# EAGLE design pwmdrive_2014_001 (EAGLE 6.5.0)
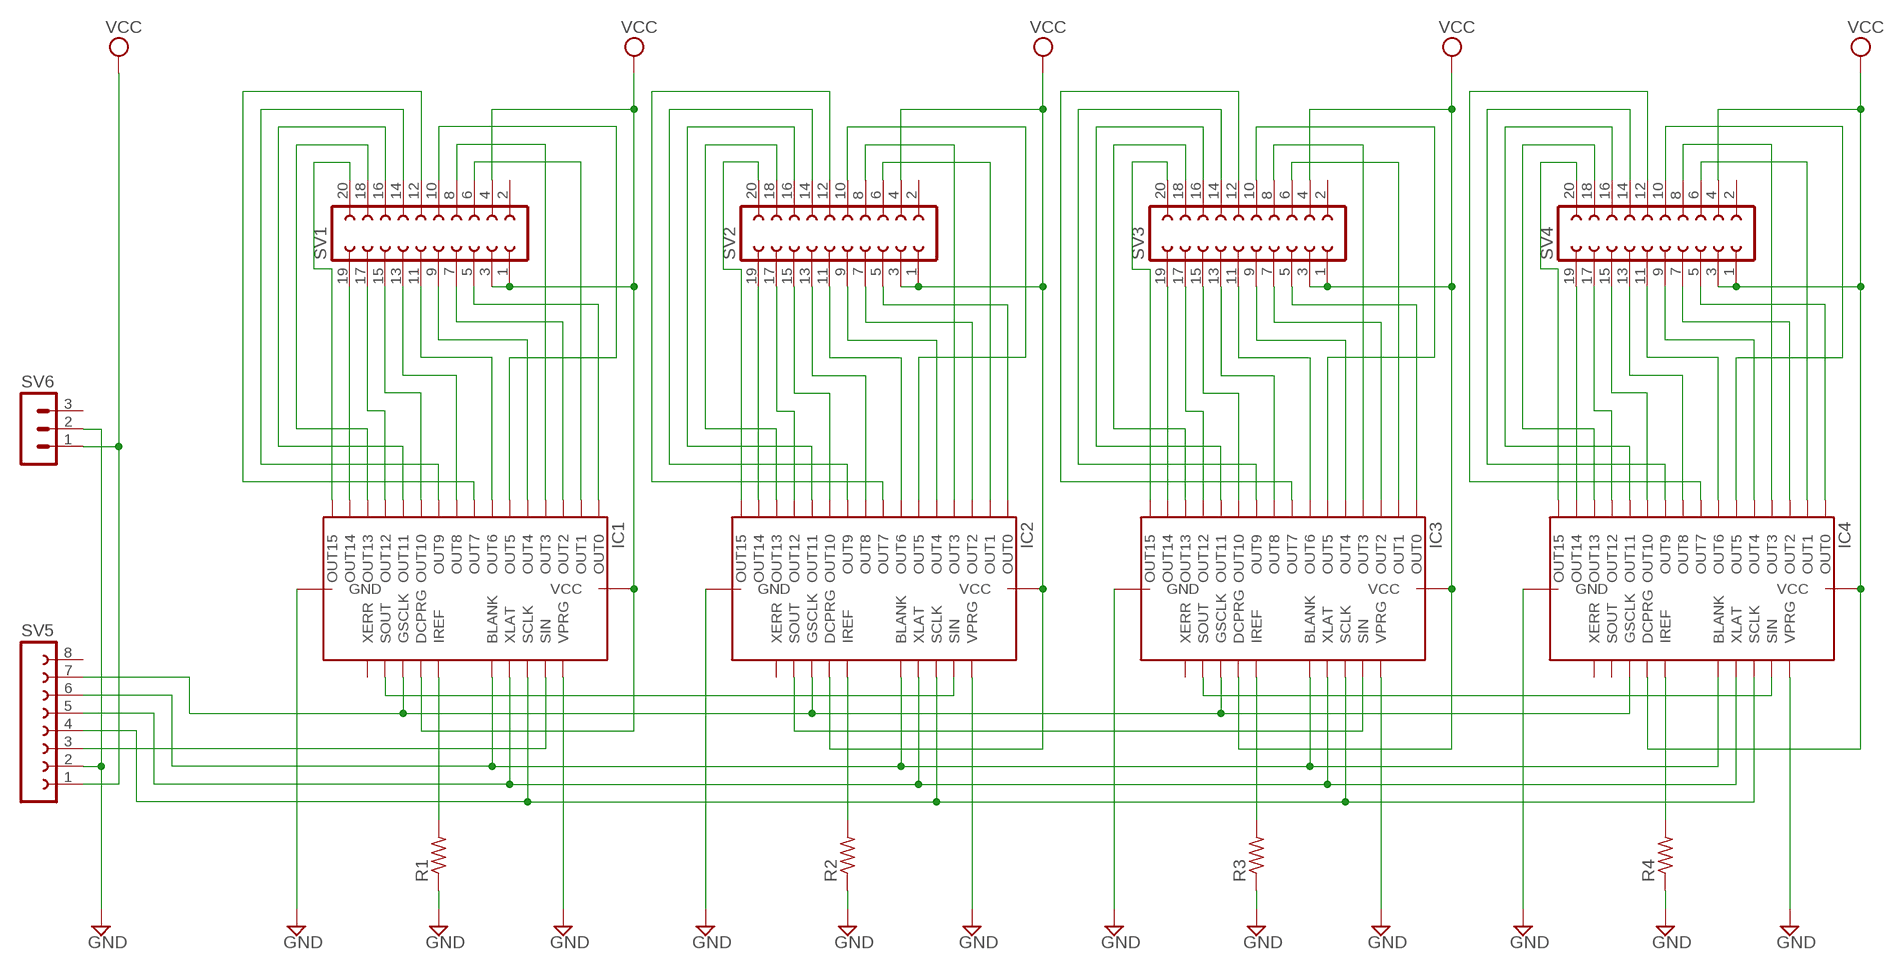
[diagram p0: schematic, sheet 1]

## Parts
IC1  IC-PACKAGE_DIL28  [IC-PACKAGE_DIL28-6]
IC2  IC-PACKAGE_DIL28  [IC-PACKAGE_DIL28-6]
IC3  IC-PACKAGE_DIL28  [IC-PACKAGE_DIL28-6]
IC4  IC-PACKAGE_DIL28  [IC-PACKAGE_DIL28-6]
R1  R-US_0204/7  [0204/7]
R2  R-US_0204/7  [0204/7]
R3  R-US_0204/7  [0204/7]
R4  R-US_0204/7  [0204/7]
SV1  FE10-2  [FE10-2]
SV2  FE10-2  [FE10-2]
SV3  FE10-2  [FE10-2]
SV4  FE10-2  [FE10-2]
SV5  FE08-1  [FE08]
SV6  MA03-1  [MA03-1]

## Nets
GND: IC1.22(GND) IC1.27(VPRG) IC2.22(GND) IC2.27(VPRG) IC3.22(GND) IC3.27(VPRG) IC4.22(GND) IC4.27(VPRG) R1.1 R2.1 R3.1 R4.1 SV5.2 SV6.2
N$1: IC1.17(SOUT) IC2.26(SIN)
N$2: IC2.17(SOUT) IC3.26(SIN)
N$3: IC3.17(SOUT) IC4.26(SIN)
N$4: IC1.24(XLAT) IC2.24(XLAT) IC3.24(XLAT) IC4.24(XLAT) SV5.5
N$5: IC1.23(BLANK) IC2.23(BLANK) IC3.23(BLANK) IC4.23(BLANK) SV5.6
N$6: IC1.25(SCLK) IC2.25(SCLK) IC3.25(SCLK) IC4.25(SCLK) SV5.4
N$8: IC1.18(GSCLK) IC2.18(GSCLK) IC3.18(GSCLK) IC4.18(GSCLK) SV5.7
N$9: IC1.20(IREF) R1.2
N$10: IC2.20(IREF) R2.2
N$11: IC3.20(IREF) R3.2
N$12: IC4.20(IREF) R4.2
N$13: IC1.26(SIN) SV5.3
N$14: IC1.14(OUT14) SV1.19
N$15: IC1.12(OUT12) SV1.17
N$16: IC1.10(OUT10) SV1.15
N$17: IC1.8(OUT8) SV1.13
N$18: IC1.6(OUT6) SV1.11
N$19: IC1.4(OUT4) SV1.9
N$20: IC1.2(OUT2) SV1.7
N$21: IC1.28(OUT0) SV1.5
N$22: IC1.1(OUT1) SV1.6
N$23: IC1.3(OUT3) SV1.8
N$25: IC1.15(OUT15) SV1.20
N$26: IC1.13(OUT13) SV1.18
N$27: IC1.11(OUT11) SV1.16
N$28: IC1.9(OUT9) SV1.14
N$29: IC1.7(OUT7) SV1.12
N$30: IC2.14(OUT14) SV2.19
N$31: IC2.28(OUT0) SV2.5
N$32: IC2.2(OUT2) SV2.7
N$33: IC2.4(OUT4) SV2.9
N$34: IC2.6(OUT6) SV2.11
N$35: IC2.8(OUT8) SV2.13
N$36: IC2.10(OUT10) SV2.15
N$37: IC2.12(OUT12) SV2.17
N$38: IC2.1(OUT1) SV2.6
N$39: IC2.3(OUT3) SV2.8
N$40: IC2.5(OUT5) SV2.10
N$41: IC2.15(OUT15) SV2.20
N$42: IC2.13(OUT13) SV2.18
N$43: IC2.11(OUT11) SV2.16
N$44: IC2.9(OUT9) SV2.14
N$45: IC2.7(OUT7) SV2.12
N$46: IC3.14(OUT14) SV3.19
N$47: IC3.28(OUT0) SV3.5
N$48: IC3.2(OUT2) SV3.7
N$49: IC3.4(OUT4) SV3.9
N$50: IC3.6(OUT6) SV3.11
N$51: IC3.8(OUT8) SV3.13
N$52: IC3.10(OUT10) SV3.15
N$53: IC3.12(OUT12) SV3.17
N$54: IC3.1(OUT1) SV3.6
N$55: IC3.3(OUT3) SV3.8
N$56: IC3.5(OUT5) SV3.10
N$57: IC3.7(OUT7) SV3.12
N$58: IC3.15(OUT15) SV3.20
N$59: IC3.13(OUT13) SV3.18
N$60: IC3.11(OUT11) SV3.16
N$61: IC3.9(OUT9) SV3.14
N$62: IC4.14(OUT14) SV4.19
N$63: IC4.28(OUT0) SV4.5
N$64: IC4.2(OUT2) SV4.7
N$65: IC4.4(OUT4) SV4.9
N$66: IC4.6(OUT6) SV4.11
N$67: IC4.8(OUT8) SV4.13
N$68: IC4.10(OUT10) SV4.15
N$69: IC4.12(OUT12) SV4.17
N$70: IC4.15(OUT15) SV4.20
N$71: IC4.13(OUT13) SV4.18
N$72: IC4.11(OUT11) SV4.16
N$73: IC4.9(OUT9) SV4.14
N$74: IC4.7(OUT7) SV4.12
N$75: IC4.1(OUT1) SV4.6
N$76: IC4.3(OUT3) SV4.8
N$77: IC4.5(OUT5) SV4.10
N$78: IC1.5(OUT5) SV1.10
VCC: IC1.19(DCPRG) IC1.21(VCC) IC2.19(DCPRG) IC2.21(VCC) IC3.19(DCPRG) IC3.21(VCC) IC4.19(DCPRG) IC4.21(VCC) SV1.1 SV1.3 SV1.4 SV2.1 SV2.3 SV2.4 SV3.1 SV3.3 SV3.4 SV4.1 SV4.3 SV4.4 SV5.1 SV6.1
Unconnected: IC1.16(XERR) IC2.16(XERR) IC3.16(XERR) IC4.16(XERR) IC4.17(SOUT) SV1.2 SV2.2 SV3.2 SV4.2 SV5.8 SV6.3

## Library data of the parts
IC1-IC4 = TLC5940:IC-PACKAGE_DIL28: Dual In Line
R1-R4 = rcl:R-US_: RESISTOR, American symbol
SV1-SV4 = con-lsta:FE10-2: FEMALE HEADER; OC_FARNELL: unknown; OC_NEWARK: unknown
SV5 = con-lsta:FE08-1: FEMALE HEADER; OC_FARNELL: unknown; OC_NEWARK: unknown
SV6 = con-lstb:MA03-1: PIN HEADER; OC_FARNELL: unknown; OC_NEWARK: unknown

## Board
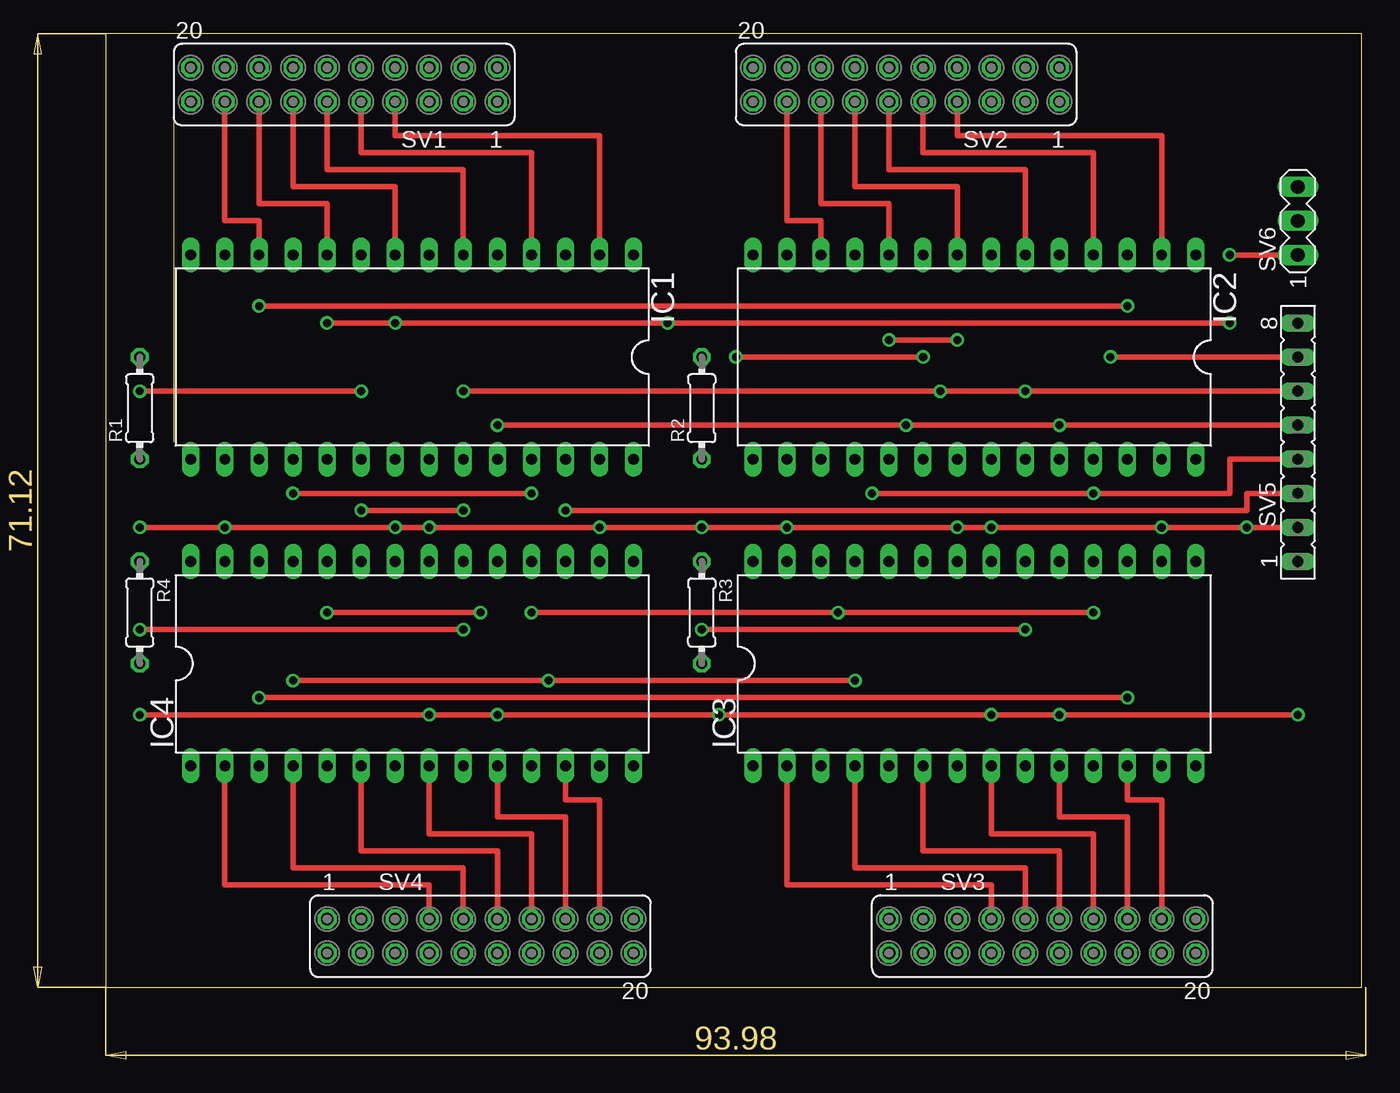
[diagram p1: board, top side]
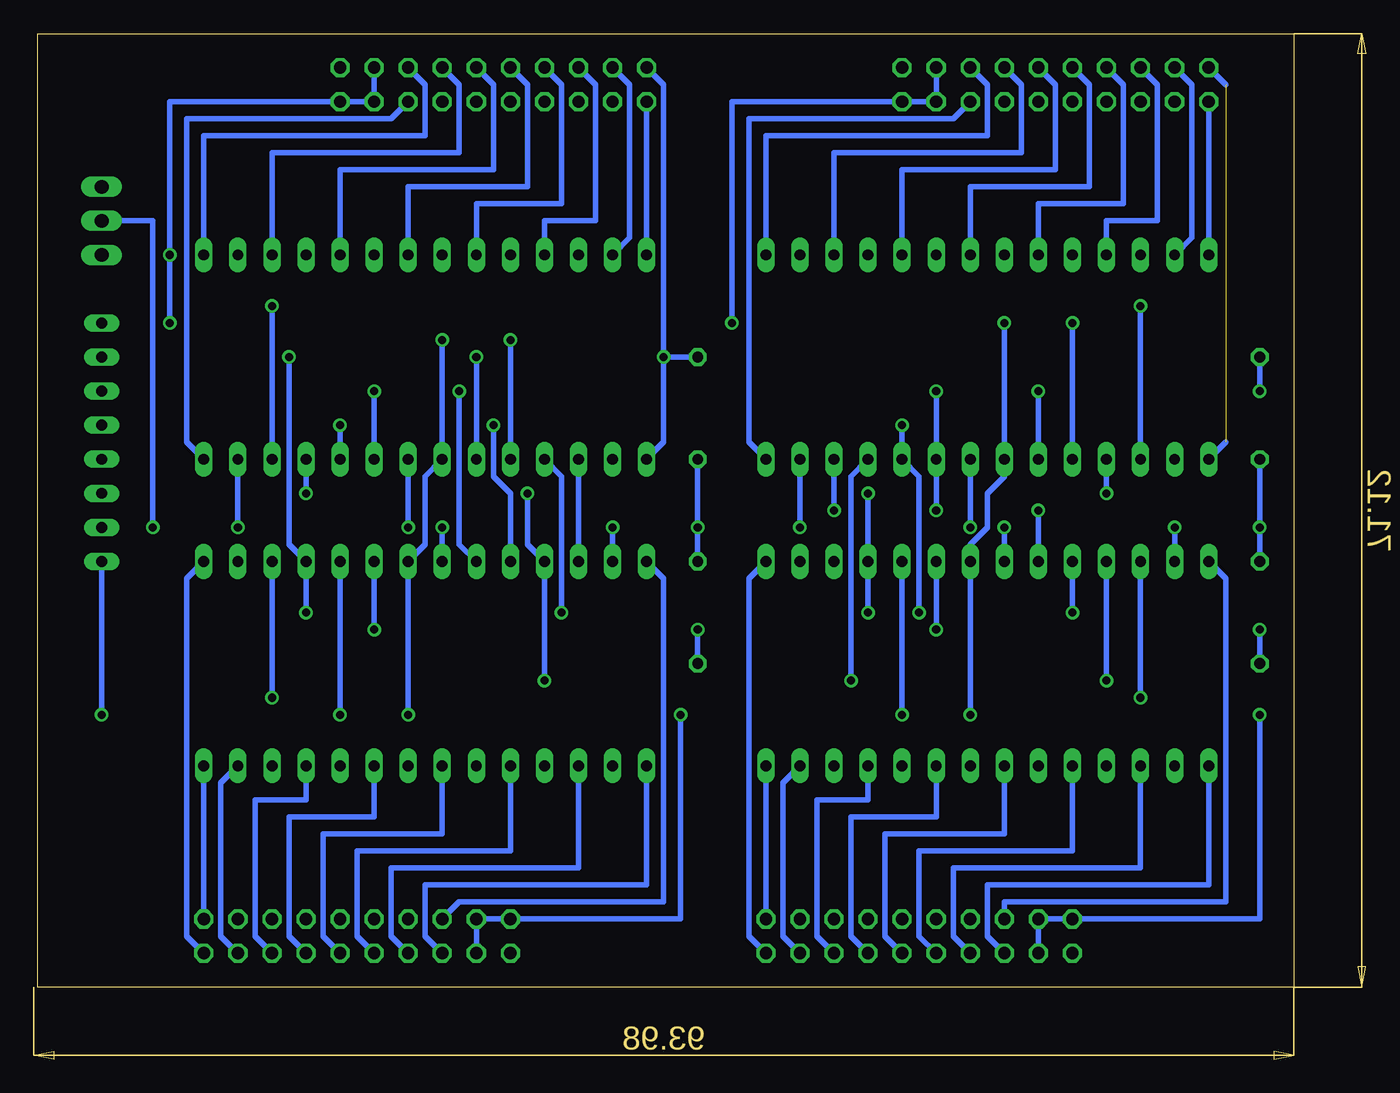
[diagram p2: board, bottom side, seen from below]

Size 93.65 x 71.11 mm. Coordinates in mm from the lower left corner, seen from the top.
Outline: 0,0 93.65,0 93.65,71.11 0,71.11 0,0
Copper layers (1*16): Top 0.035mm / dielectric 1.5mm / Bottom 0.035mm
Design rules "default": minimum track width 10mil, minimum drill 24mil, track to track 8mil, track to pad 8mil, pad to pad 8mil, via to via 8mil, smd to smd 8mil, copper to edge 40mil, drill to drill 8mil, minimum pad ring 10mil, minimum via ring 8mil, stop-mask expansion 4mil, vias tented up to drill 0mil, thermal gap 10mil

### Footprints (pad centres in the part's own frame; a part is rotated, then mirrored left to right if it is on the bottom)
IC-PACKAGE_DIL28-6 = drill 0.813 long: 1 -16.51,-7.62; 2 -13.97,-7.62; 3 -11.43,-7.62; 4 -8.89,-7.62; 5 -6.35,-7.62; 6 -3.81,-7.62; 7 -1.27,-7.62; 8 1.27,-7.62; 9 3.81,-7.62; 10 6.35,-7.62; 11 8.89,-7.62; 12 11.43,-7.62; 13 13.97,-7.62; 14 16.51,-7.62; 15 16.51,7.62; 16 13.97,7.62; 17 11.43,7.62; 18 8.89,7.62; 19 6.35,7.62; 20 3.81,7.62; 21 1.27,7.62; 22 -1.27,7.62; 23 -3.81,7.62; 24 -6.35,7.62; 25 -8.89,7.62; 26 -11.43,7.62; 27 -13.97,7.62; 28 -16.51,7.62
0204/7 = drill 0.813 octagon: 1 -3.81,0; 2 3.81,0
FE10-2 = drill 0.914 octagon: 1 -11.43,1.27; 2 -11.43,-1.27; 3 -8.89,1.27; 4 -8.89,-1.27; 5 -6.35,1.27; 6 -6.35,-1.27; 7 -3.81,1.27; 8 -3.81,-1.27; 9 -1.27,1.27; 10 -1.27,-1.27; 11 1.27,1.27; 12 1.27,-1.27; 13 3.81,1.27; 14 3.81,-1.27; 15 6.35,1.27; 16 6.35,-1.27; 17 8.89,1.27; 18 8.89,-1.27; 19 11.43,1.27; 20 11.43,-1.27
FE08 = drill 0.813 long: 1 -8.89,0; 2 -6.35,0; 3 -3.81,0; 4 -1.27,0; 5 1.27,0; 6 3.81,0; 7 6.35,0; 8 8.89,0
MA03-1 = drill 1.016 long: 1 -2.54,0; 2 0,0; 3 2.54,0

### Placement (x,y rotation side)
IC1  22.86,46.99 180 top
IC2  64.77,46.99 180 top
IC3  64.77,24.13 0 top
IC4  22.86,24.13 0 top
R1  2.54,43.18 90 top
R2  44.45,43.18 90 top
R3  44.45,27.94 270 top
R4  2.54,27.94 270 top
SV1  17.78,67.31 180 top
SV2  59.69,67.31 180 top
SV3  69.85,3.81 0 top
SV4  27.94,3.81 0 top
SV5  88.9,40.64 90 top
SV6  88.9,57.15 90 top

### Tracks (layer width: path | path; a pad name or v marks a point on that pad's centre or on a via)
GND  (via drill 0.6)
  Top 0.406: SV5.2 v85.09,34.29 v78.74,34.29 v66.04,34.29 v63.5,34.29 v50.8,34.29 v44.45,34.29 v36.83,34.29 v24.13,34.29 v21.59,34.29 v8.89,34.29 v2.54,34.29
  Bottom 0.406: IC2.27 v78.74,34.29 | v66.04,34.29 IC2.22 | v63.5,34.29 IC3.22 | IC1.27 v36.83,34.29 | IC1.22 v24.13,34.29 | v21.59,34.29 IC4.22 | IC4.27 v8.89,34.29 | R2.1 v44.45,34.29 R3.1 | v50.8,34.29 IC3.27 | R1.1 v2.54,34.29 R4.1 | SV6.2 85.09,57.15 v85.09,34.29
N$1  (via drill 0.6)
  Top 0.406: v11.43,50.8 v76.2,50.8
  Bottom 0.406: IC1.17 v11.43,50.8 | IC2.26 v76.2,50.8
N$2
  Bottom 0.406: IC2.17 IC3.26
N$3  (via drill 0.6)
  Top 0.406: v11.43,21.59 v76.2,21.59
  Bottom 0.406: IC4.26 v11.43,21.59 | IC3.17 v76.2,21.59
N$4  (via drill 0.6)
  Top 0.406: v29.21,41.91 v59.69,41.91 v71.12,41.91 SV5.5 | v16.51,27.94 v27.94,27.94
  Bottom 0.406: IC3.24 58.42,36.83 59.69,38.1 v59.69,41.91 | IC2.24 v71.12,41.91 | v29.21,41.91 IC1.24 27.94,38.1 v27.94,27.94 | IC4.24 v16.51,27.94
N$5  (via drill 0.6)
  Top 0.406: v19.05,35.56 v26.67,35.56 | SV5.6 v68.58,44.45 v62.23,44.45 v26.67,44.45
  Bottom 0.406: IC4.23 v19.05,35.56 | IC2.23 v68.58,44.45 | IC3.23 62.23,33.02 v62.23,44.45 | v26.67,35.56 IC1.23 v26.67,44.45
N$6  (via drill 0.6)
  Top 0.406: SV5.4 83.82,39.37 83.82,36.83 v73.66,36.83 v57.15,36.83 | v13.97,22.86 v33.02,22.86 v55.88,22.86
  Bottom 0.406: IC1.25 33.02,38.1 v33.02,22.86 | v55.88,22.86 IC3.25 57.15,33.02 v57.15,36.83 | IC2.25 v73.66,36.83 | IC4.25 v13.97,22.86
N$8  (via drill 0.6)
  Top 0.406: v31.75,36.83 v13.97,36.83 | v31.75,27.94 v54.61,27.94 v73.66,27.94 | v74.93,46.99 SV5.7
  Bottom 0.406: v54.61,27.94 54.61,38.1 IC2.18 | v31.75,36.83 IC4.18 v31.75,27.94 | v73.66,27.94 IC3.18 74.93,33.02 v74.93,46.99 | v13.97,36.83 IC1.18
N$9  (via drill 0.6)
  Top 0.406: v2.54,44.45 v19.05,44.45
  Bottom 0.406: IC1.20 v19.05,44.45 | v2.54,44.45 R1.2
N$10  (via drill 0.6)
  Top 0.406: v46.99,46.99 v60.96,46.99
  Bottom 0.406: v60.96,46.99 IC2.20 | R2.2 v46.99,46.99
N$11  (via drill 0.6)
  Top 0.406: v44.45,26.67 v68.58,26.67
  Bottom 0.406: IC3.20 v68.58,26.67 | R3.2 v44.45,26.67
N$12  (via drill 0.6)
  Top 0.406: v2.54,26.67 v26.67,26.67
  Bottom 0.406: IC4.20 v26.67,26.67 | R4.2 v2.54,26.67
N$13  (via drill 0.6)
  Top 0.406: SV5.3 85.09,36.83 85.09,35.56 v34.29,35.56
  Bottom 0.406: IC1.26 v34.29,35.56
N$14
  Bottom 0.406: IC1.14 SV1.19
N$15
  Top 0.406: SV1.17 8.89,57.15 11.43,57.15 IC1.12
N$16
  Top 0.406: SV1.15 11.43,58.42 16.51,58.42 IC1.10
N$17
  Top 0.406: SV1.13 13.97,59.69 21.59,59.69 IC1.8
N$18
  Top 0.406: SV1.11 16.51,60.96 26.67,60.96 IC1.6
N$19
  Top 0.406: SV1.9 19.05,62.23 31.75,62.23 IC1.4
N$20
  Top 0.406: SV1.7 21.59,63.5 36.83,63.5 IC1.2
N$21
  Bottom 0.406: SV1.5 25.4,64.77 40.64,64.77 40.64,40.64 IC1.28
N$22
  Bottom 0.406: SV1.6 22.86,67.31 22.86,63.5 39.37,63.5 IC1.1
N$23
  Bottom 0.406: SV1.8 20.32,67.31 20.32,62.23 34.29,62.23 IC1.3
N$25  (1 unrouted)
  Bottom 0.406: SV1.20 5.08,67.31 | 5.08,40.64 IC1.15
N$26
  Bottom 0.406: SV1.18 7.62,67.31 7.62,55.88 IC1.13
N$27
  Bottom 0.406: SV1.16 10.16,67.31 10.16,57.15 13.97,57.15 IC1.11
N$28
  Bottom 0.406: SV1.14 12.7,67.31 12.7,58.42 19.05,58.42 IC1.9
N$29
  Bottom 0.406: SV1.12 15.24,67.31 15.24,59.69 24.13,59.69 IC1.7
N$30
  Bottom 0.406: SV2.19 IC2.14
N$31
  Bottom 0.406: SV2.5 67.31,64.77 82.55,64.77 82.55,40.64 IC2.28
N$32
  Top 0.406: SV2.7 63.5,63.5 78.74,63.5 IC2.2
N$33
  Top 0.406: SV2.9 60.96,62.23 73.66,62.23 IC2.4
N$34
  Top 0.406: SV2.11 58.42,60.96 68.58,60.96 IC2.6
N$35
  Top 0.406: SV2.13 55.88,59.69 63.5,59.69 IC2.8
N$36
  Top 0.406: SV2.15 53.34,58.42 58.42,58.42 IC2.10
N$37
  Top 0.406: SV2.17 50.8,57.15 53.34,57.15 IC2.12
N$38
  Bottom 0.406: SV2.6 64.77,67.31 64.77,63.5 81.28,63.5 IC2.1
N$39
  Bottom 0.406: SV2.8 62.23,67.31 62.23,62.23 76.2,62.23 IC2.3
N$40
  Bottom 0.406: SV2.10 59.69,67.31 59.69,60.96 71.12,60.96 IC2.5
N$41
  Bottom 0.406: SV2.20 46.99,67.31 46.99,40.64 IC2.15
N$42
  Bottom 0.406: SV2.18 49.53,67.31 49.53,55.88 IC2.13
N$43
  Bottom 0.406: SV2.16 52.07,67.31 52.07,57.15 55.88,57.15 IC2.11
N$44
  Bottom 0.406: SV2.14 54.61,67.31 54.61,58.42 60.96,58.42 IC2.9
N$45
  Bottom 0.406: SV2.12 57.15,67.31 57.15,59.69 66.04,59.69 IC2.7
N$46
  Bottom 0.406: SV3.19 IC3.14
N$47
  Bottom 0.406: SV3.5 62.23,6.35 46.99,6.35 46.99,30.48 IC3.28
N$48
  Top 0.406: SV3.7 66.04,7.62 50.8,7.62 IC3.2
N$49
  Top 0.406: SV3.9 68.58,8.89 55.88,8.89 IC3.4
N$50
  Top 0.406: SV3.11 71.12,10.16 60.96,10.16 IC3.6
N$51
  Top 0.406: SV3.13 73.66,11.43 66.04,11.43 IC3.8
N$52
  Top 0.406: SV3.15 76.2,12.7 71.12,12.7 IC3.10
N$53
  Top 0.406: SV3.17 78.74,13.97 76.2,13.97 IC3.12
N$54
  Bottom 0.406: SV3.6 64.77,3.81 64.77,7.62 48.26,7.62 IC3.1
N$55
  Bottom 0.406: SV3.8 67.31,3.81 67.31,8.89 53.34,8.89 IC3.3
N$56
  Bottom 0.406: SV3.10 69.85,3.81 69.85,10.16 58.42,10.16 IC3.5
N$57
  Bottom 0.406: SV3.12 72.39,3.81 72.39,11.43 63.5,11.43 IC3.7
N$58
  Bottom 0.406: SV3.20 82.55,3.81 82.55,30.48 IC3.15
N$59
  Bottom 0.406: SV3.18 80.01,3.81 80.01,15.24 IC3.13
N$60
  Bottom 0.406: SV3.16 77.47,3.81 77.47,13.97 73.66,13.97 IC3.11
N$61
  Bottom 0.406: SV3.14 74.93,3.81 74.93,12.7 68.58,12.7 IC3.9
N$62
  Bottom 0.406: SV4.19 IC4.14
N$63
  Bottom 0.406: SV4.5 21.59,6.35 5.08,6.35 5.08,30.48 IC4.28
N$64
  Top 0.406: SV4.7 24.13,7.62 8.89,7.62 IC4.2
N$65
  Top 0.406: SV4.9 26.67,8.89 13.97,8.89 IC4.4
N$66
  Top 0.406: SV4.11 29.21,10.16 19.05,10.16 IC4.6
N$67
  Top 0.406: SV4.13 31.75,11.43 24.13,11.43 IC4.8
N$68
  Top 0.406: SV4.15 34.29,12.7 29.21,12.7 IC4.10
N$69
  Top 0.406: SV4.17 36.83,13.97 34.29,13.97 IC4.12
N$70
  Bottom 0.406: SV4.20 40.64,3.81 40.64,30.48 IC4.15
N$71
  Bottom 0.406: SV4.18 38.1,3.81 38.1,15.24 IC4.13
N$72
  Bottom 0.406: SV4.16 35.56,3.81 35.56,13.97 31.75,13.97 IC4.11
N$73
  Bottom 0.406: SV4.14 33.02,3.81 33.02,12.7 26.67,12.7 IC4.9
N$74
  Bottom 0.406: SV4.12 30.48,3.81 30.48,11.43 21.59,11.43 IC4.7
N$75
  Bottom 0.406: SV4.6 22.86,3.81 22.86,7.62 6.35,7.62 IC4.1
N$76
  Bottom 0.406: SV4.8 25.4,3.81 25.4,8.89 11.43,8.89 IC4.3
N$77
  Bottom 0.406: SV4.10 27.94,3.81 27.94,10.16 16.51,10.16 IC4.5
N$78
  Bottom 0.406: SV1.10 17.78,67.31 17.78,60.96 29.21,60.96 IC1.5
VCC  (via drill 0.6)
  Top 0.406: v88.9,20.32 v71.12,20.32 v66.04,20.32 v45.72,20.32 v29.21,20.32 v24.13,20.32 v2.54,20.32 | v16.51,49.53 v21.59,49.53 v41.91,49.53 v83.82,49.53 | v58.42,48.26 v63.5,48.26 | SV6.1 v83.82,54.61
  Bottom 0.406: SV2.4 SV2.3 SV2.1 83.82,66.04 v83.82,54.61 v83.82,49.53 | SV1.4 SV1.3 | SV1.3 SV1.1 | SV4.4 SV4.3 SV4.1 2.54,5.08 v2.54,20.32 | SV3.4 SV3.3 | SV3.3 SV3.1 | SV5.1 v88.9,20.32 | IC3.19 v71.12,20.32 | v66.04,20.32 IC3.21 64.77,33.02 64.77,38.1 IC2.21 v63.5,48.26 | IC4.19 v29.21,20.32 | v24.13,20.32 IC4.21 24.13,33.02 22.86,34.29 22.86,36.83 21.59,38.1 IC1.21 v21.59,49.53 | SV1.3 41.91,66.04 v41.91,49.53 | IC1.19 v16.51,49.53 | SV3.3 45.72,5.08 v45.72,20.32 | IC2.19 v58.42,48.26